# Altium schematic sheet QCopterRC_LED_Sch.SchDoc
size A4
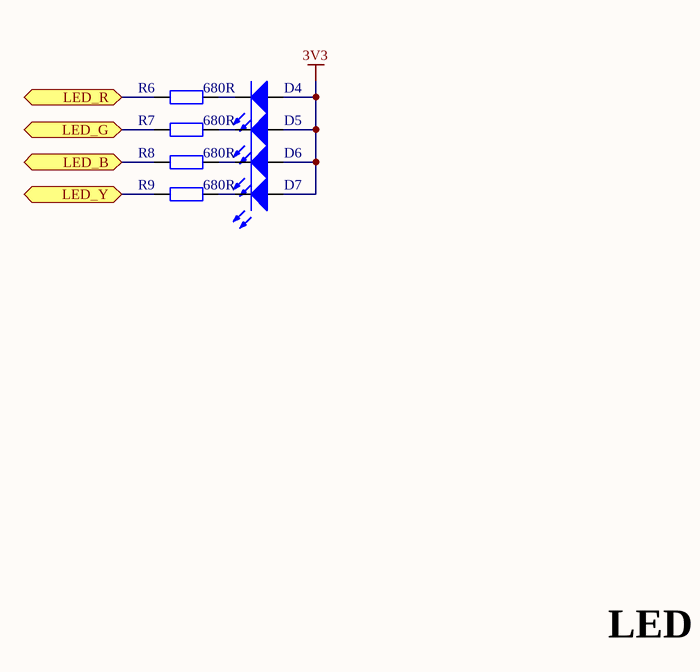
[diagram p0: QCopterRC_LED_Sch.SchDoc]

## Parts
D4  LED_0603_RED  [LED_0603_RED]  (value not drawn)
D5  LED_0603_GREEN  [LED_0603_GREEN]  (value not drawn)
D6  LED_0603_BLUE  [LED_0603_BLUE]  (value not drawn)
D7  LED_0603_YELLOW  [LED_0603_YELLOW]  (value not drawn)
R6  value 680R  [RES_0603]  (hidden comment: Res_0603)
R7  value 680R  [RES_0603]  (hidden comment: Res_0603)
R8  value 680R  [RES_0603]  (hidden comment: Res_0603)
R9  value 680R  [RES_0603]  (hidden comment: Res_0603)

## Ports
LED_B, LED_G, LED_R, LED_Y

## Nets
3V3: D4.1(A) D5.1(A) D6.1(A) D7.1(A)
LED_B: R8.1 ; port LED_B
LED_G: R7.1 ; port LED_G
LED_R: R6.1 ; port LED_R
LED_Y: R9.1 ; port LED_Y
NetD4_2: D4.2(K) R6.2
NetD5_2: D5.2(K) R7.2
NetD6_2: D6.2(K) R8.2
NetD7_2: D7.2(K) R9.2

## Notes on the sheet
- LED

## Library data of the parts
D4 = LED_0603_RED: LED
D5 = LED_0603_GREEN: LED
D6 = LED_0603_BLUE: LED
D7 = LED_0603_YELLOW: LED
R6-R9 = Res_0603: Resistor